# Altium schematic sheet Sheet1.SchDoc
size A4; SheetNumber: 1; SheetTotal: 1
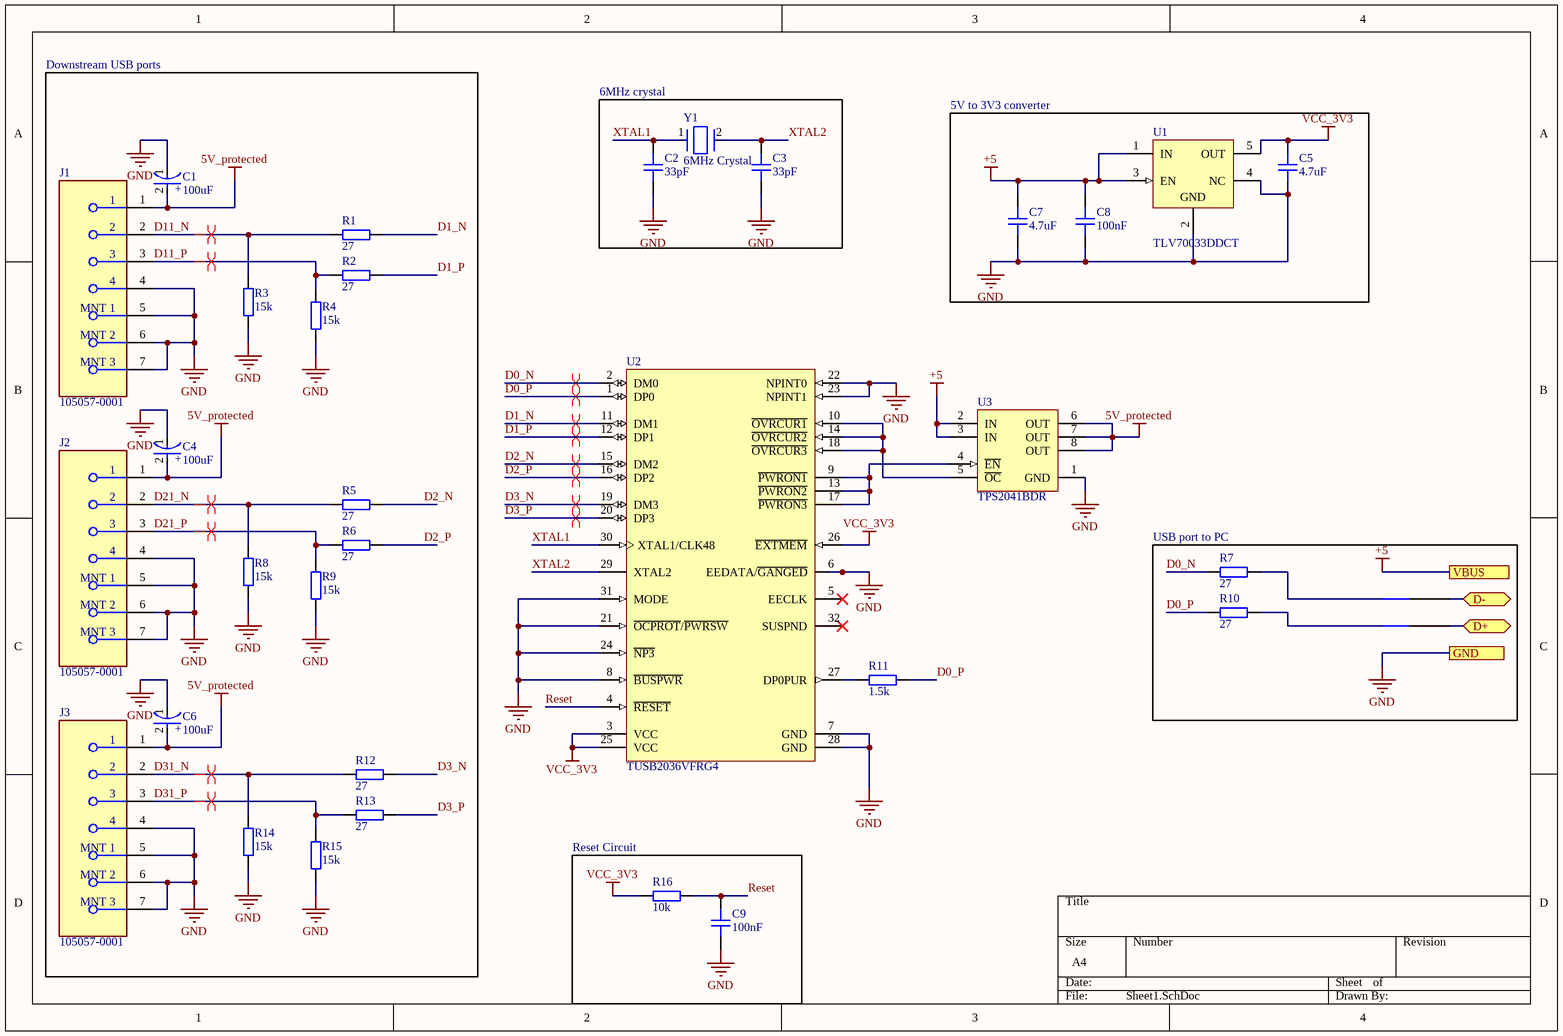
[diagram p0: Sheet1.SchDoc]

## Parts
C1  100uF  [FP-TPSB-MFG]
C2  33pF  [CAP_0603]
C3  33pF  [CAP_0603]
C4  100uF  [FP-TPSB-MFG]
C5  4.7uF  [CAP_0603]
C6  100uF  [FP-TPSB-MFG]
C7  4.7uF  [CAP_0603]
C8  100nF  [CAP_0603]
C9  100nF  [CAP_0603]
J1  105057-0001  [FP-105057-0001-MFG]
J2  105057-0001  [FP-105057-0001-MFG]
J3  105057-0001  [FP-105057-0001-MFG]
NT1  NT  [NETTIE_SMD]  (value not drawn)  (net tie, no BOM)
NT2  NT  [NETTIE_SMD]  (value not drawn)  (net tie, no BOM)
R1  27  [RES_0603]
R2  27  [RES_0603]
R3  15k  [RES_0603]
R4  15k  [RES_0603]
R5  27  [RES_0603]
R6  27  [RES_0603]
R7  27  [RES_0603]
R8  15k  [RES_0603]
R9  15k  [RES_0603]
R10  27  [RES_0603]
R11  1.5k  [RES_0603]
R12  27  [RES_0603]
R13  27  [RES_0603]
R14  15k  [RES_0603]
R15  15k  [RES_0603]
R16  10k  [RES_0603]
U1  TLV70033DDCT  [DDC0005A_M]
U2  TUSB2036VFRG4  [VF32_N]
U3  TPS2041BDR  [D0008A_L]
Y1  6MHz Crystal  [FP-ABLS2-MFG]

## Blocks framed on the sheet
Downstream USB ports: C1 C4 C6 J1-J3 R1-R6 R8 R9 R12-R15
6MHz crystal: C2 C3 Y1
5V to 3V3 converter: C5 C7 C8 U1
USB port to PC: NT1 NT2 R7 R10
Reset Circuit: C9 R16

## Ports
D+ (bidir), D- (bidir), GND, VBUS

## Nets
5V_protected: C1.2(A) C4.2(A) C6.2(A) J1.1 J2.1 J3.1 U3.6(OUT) U3.7(OUT) U3.8(OUT)
+5: C7.2 C8.2 U1.1(IN) U1.3(EN) U3.2(IN) U3.3(IN) ; port VBUS
GND: C1.1(C) C2.1 C3.1 C4.1(C) C5.1 C6.1(C) C7.1 C8.1 C9.1 J1.4 J1.5(MNT_1) J1.6(MNT_2) J1.7(MNT_3) J2.4 J2.5(MNT_1) J2.6(MNT_2) J2.7(MNT_3) J3.4 J3.5(MNT_1) J3.6(MNT_2) J3.7(MNT_3) R3.1 R4.1 R8.1 R9.1 R14.1 R15.1 U1.2(GND) U1.4(NC) U2.6(EEDATA/~{GANGED}) U2.7(GND) U2.8(~{BUSPWR}) U2.21(~{OCPROT}/~{PWRSW}) U2.22(NPINT0) U2.23(NPINT1) U2.24(~{NP3}) U2.28(GND) U2.31(MODE) U3.1(GND) ; port GND
VCC_3V3: C5.2 R16.1 U1.5(OUT) U2.3(VCC) U2.25(VCC) U2.26(~{EXTMEM})
D0_N: R7.1 U2.2(DM0)
D0_P: R10.1 R11.2 U2.1(DP0)
D1_N: R1.2 U2.11(DM1)
D1_P: R2.2 U2.12(DP1)
D2_N: R5.2 U2.15(DM2)
D2_P: R6.2 U2.16(DP2)
D3_N: R12.2 U2.19(DM3)
D3_P: R13.2 U2.20(DP3)
D11_N: J1.2 R1.1 R3.2
D11_P: J1.3 R2.1 R4.2
D21_N: J2.2 R5.1 R8.2
D21_P: J2.3 R6.1 R9.2
D31_N: J3.2 R12.1 R14.2
D31_P: J3.3 R13.1 R15.2
Reset: C9.2 R16.2 U2.4(~{RESET})
XTAL1: C2.2 U2.30(XTAL1/CLK48) Y1.1
XTAL2: C3.2 U2.29(XTAL2) Y1.2
NetNT1_1: NT1.1 R7.2
NetNT2_1: NT2.1 R10.2
NetR11_1: R11.1 U2.27(DP0PUR)
NetU2_9: U2.9(~{PWRON1}) U2.13(~{PWRON2}) U2.17(~{PWRON3}) U3.4(~{EN})
NetU2_10: U2.10(~{OVRCUR1}) U2.14(~{OVRCUR2}) U2.18(~{OVRCUR3}) U3.5(~{OC})

Not connected (* = marked no-connect by the designer): NT1 2; NT2 2; U2 5(EECLK)* 32(SUSPND)*

## Layout directives
differential pair: D0_N, D0_P, D1_N, D1_P, D2_N, D2_P, D3_N, D3_P, D11_N, D11_P, D21_N, D21_P, D31_N, D31_P

## Notes on the sheet
- (in symbol CMP-04424-000211-1) +

## Library data of the parts
C1 C4 C6 = CMP-04424-000211-1: CAP TANT 100UF 10% 6.3V 1411 TPSB107K006R0400; Dielectric Material: Tantalum; Leakage Current: 6.3uA; ESR (Equivalent Series Resistance): 400mR; Polarity: Polar; Packaging: Tape and Reel; Lead Free: Lead Free; RoHS Compliant: Yes; Case/Package: 1210; Mount: Surface Mount; Case Code (Metric): 3528; Depth: 2.8mm; Voltage Rating: 6.3V; REACH SVHC: No SVHC; Tolerance: 10%; Max Operating Temperature: 125°C; Package Quantity: 1; Height - Seated (Max): 0.083inch; Min Operating Temperature: -55°C; Case Code (Imperial): 1210; Capacitance: 100uF; Length: 3.5mm; Termination: SMD/SMT; Features: General Purpose; Voltage Rating (DC): 6.3V; Weight: 0.000564oz; Width: 0.11inch; Voltage: 6.3V; Construction: Flat; Series: TPS; Radiation Hardening: No; Height: 1.9mm; Dissipation Factor: 10%
C2 C3 C5 C7-C9 = CAP_0603: Capacitor SMD 0603; Manufacturer: *; Manufacturer Part Number: *; Distributor Link: *; LCSC: *; Rating: *; Dielectric: *
J1-J3 = CMP-04767-000006-1: CONN RCPT USB2.0 TYPEA 4POS VERT; Manufacturer: Molex; Number Of Contacts: 4; Conn Orientation: Vertical; Description: USB - A USB 2.0 Receptacle Connector 4 Position Through Hole; Shielding: true; Voltage Rating: 30V; Current Rating: 1.5A; Is Female: yes; Package: 105057-0001; ComponentLink2URL: https://www.molex.com/webdocs/datasheets/pdf/en-us/1050570001_IO_CONNECTORS.pdf; ComponentLink2Description: Datasheet; Footprint Url: https://www.molex.com/pdm_docs/sd/1050570001_sd.pdf; Temperature: -40°C to +85°C; Digikey Description: CONN RCPT USB2.0 TYPEA 4POS VERT; Contact Material: Gold,Nickel; Device Class L3: unset; Device Class L1: Connectors; Height: 10.75mm; Temperature Range High: +85°C; Usb Standard: USB 2.0; Category: Conn; Manufacturer Part Number: 105057-0001; Device Class L2: USB Connectors; RoHS: TRUE; Lead Free: Yes; Temperature Range Low: -40°C; Octopart: https://octopart.com/105057-0001-molex-19914270; Automotive: No
NT1 NT2 = NetTie_SMD: Net tie smd
R1-R16 = RES_0603: Resistor SMD 0603; Manufacturer: *; Manufacturer Part Number: *; Distributor Link: *; LCSC: *
U1 = CMP-0394-01055-2: Single Output LDO, 200 mA, Fixed 3.3 V Output, 2 to 5.5 V Input, with Low IQ, 5-pin SOT (DDC), -40 to 125 degC, Green (RoHS & no Sb/Br); Manufacturer: Texas Instruments; Vin(Min)(V): 2; Vout Adj(Min)(V): 3.3; Iout(Max)(A): 0.2; Vdo(Typ)(mV): 175; Iq(Typ)(mA): 0.03; Vin(Max)(V): 5.5; SubFamily: Single Channel LDO; Mounting Technology: Surface Mount; ComponentLink2URL: http://www.ti.com/general/docs/lit/getliterature.tsp?genericPartNumber=TLV70033&fileType=pdf; PackageReference: DDC0005A; Eco-Plan: Green (RoHS & no Sb/Br); Fixed Output Options(V): 3.3; Accuracy(%): 2; DatasheetVersion: SLVSA00D; Vout Adj(Max)(V): 3.3; PartNumber: TLV70033DDCT; ComponentLink3URL: http://www.ti.com/litv/pdf/mpds123d; ComponentLink1URL: http://www.ti.com/; ComponentLink3Description: Package Specification; PackageDescription: 5-Pin Plastic Small Outline, Body 2.9 x 1.6 mm, 0.95 mm Pitch; PackageVersion: 4204403-2/E; Code_JEDEC: MO-193; ComponentLink2Description: Datasheet; ComponentLink1Description: Manufacturer URL
U2 = CMP-0309-00080-1: 2 / 3-Port Hub for USB with Optional Serial EEPROM Interface, 3.3V, 0 to 70 degC, 32-Pin LQFP (VF), Green (RoHS & no Sb/Br); Manufacturer: Texas Instruments; USB Full Speed: True; Supply Voltage(s)(V): 3.3; SubFamily: USB Hub Controller; USB Speed: Full; ComponentLink1Description: Datasheet; Integrated MCU Architecture: N/A; DatasheetVersion: SLLS372E; PackageDescription: 32-Pin Plastic Quad Flatpack, 7 x 7 mm Body, 0.8 mm Pitch; PackageVersion: revD, Apr-2000; PartNumber: TUSB2036VFRG4; ComponentLink1URL: http://www.ti.com/general/docs/lit/getliterature.tsp?genericPartNumber=TUSB2036&fileType=pdf; ComponentLink2Description: Package Specification; Eco-Plan: Green (RoHS & no Sb/Br); ComponentLink2URL: http://www.ti.com/litv/pdf/mtqf002b; Mounting Technology: Surface Mount; PackageReference: VF32
U3 = CMP-0337-00094-2: Single-Channel Current-Limited Power Distribution Switch, 1 A Current Limit, -40 to 85 degC, 8-pin SOIC (D), Green (RoHS & no Sb/Br); Manufacturer: Texas Instruments; NEMKO: TRUE; Enable: Active Low; Vin(Min)(V): 2.7; Rating: Catalog; Continuous Current(Max)(A): 0.5; Current Limit(A): 1; Vin(Max)(V): 5.5; rDS(on) per FET(Typ)(mOhms): 70; DatasheetVersion: SLVS514L; ComponentLink1URL: http://www.ti.com/general/docs/lit/getliterature.tsp?genericPartNumber=TPS2041B&fileType=pdf; PackageReference: D0008A; PackageDescription: 8-Pin Plastic Small Outline Integrated Circuit, 4.9 x 3.9 mm, Pitch 1.27 mm Pitch; ComponentLink1Description: Datasheet; PackageVersion: revM, Jun-2011; UL Listed: TRUE; Mounting Technology: Surface Mount; PartNumber: TPS2041BDR; Number of Switches: 1; Eco-Plan: Green (RoHS & no Sb/Br); Code_JEDEC: MS-012AA
Y1 = CMP-27762-000920-1: CRYSTAL 6.0000MHZ 18PF SMD ABLS2-6.000MHZ-D4Y-T; ESR (Equivalent Series Resistance): 100R; Frequency Tolerance: 30ppm; Width: 4.7mm; Operating Frequency: 6 MHz; Termination: SMD/SMT; Height: 0.13inch; Load Capacitance: 18pF; Package Quantity: 1000; Max Operating Temperature: 85°C; Series: ABLS2; Mount: Surface Mount; Length: 11.4mm; Depth: 4.7mm; Lead Free: Lead Free; Tolerance: 30ppm; Series Resistance: 100R; Frequency Stability: 30ppm; Packaging: Tape and Reel; Number of Pins: 2; Frequency: 6MHz; Min Operating Temperature: -40°C